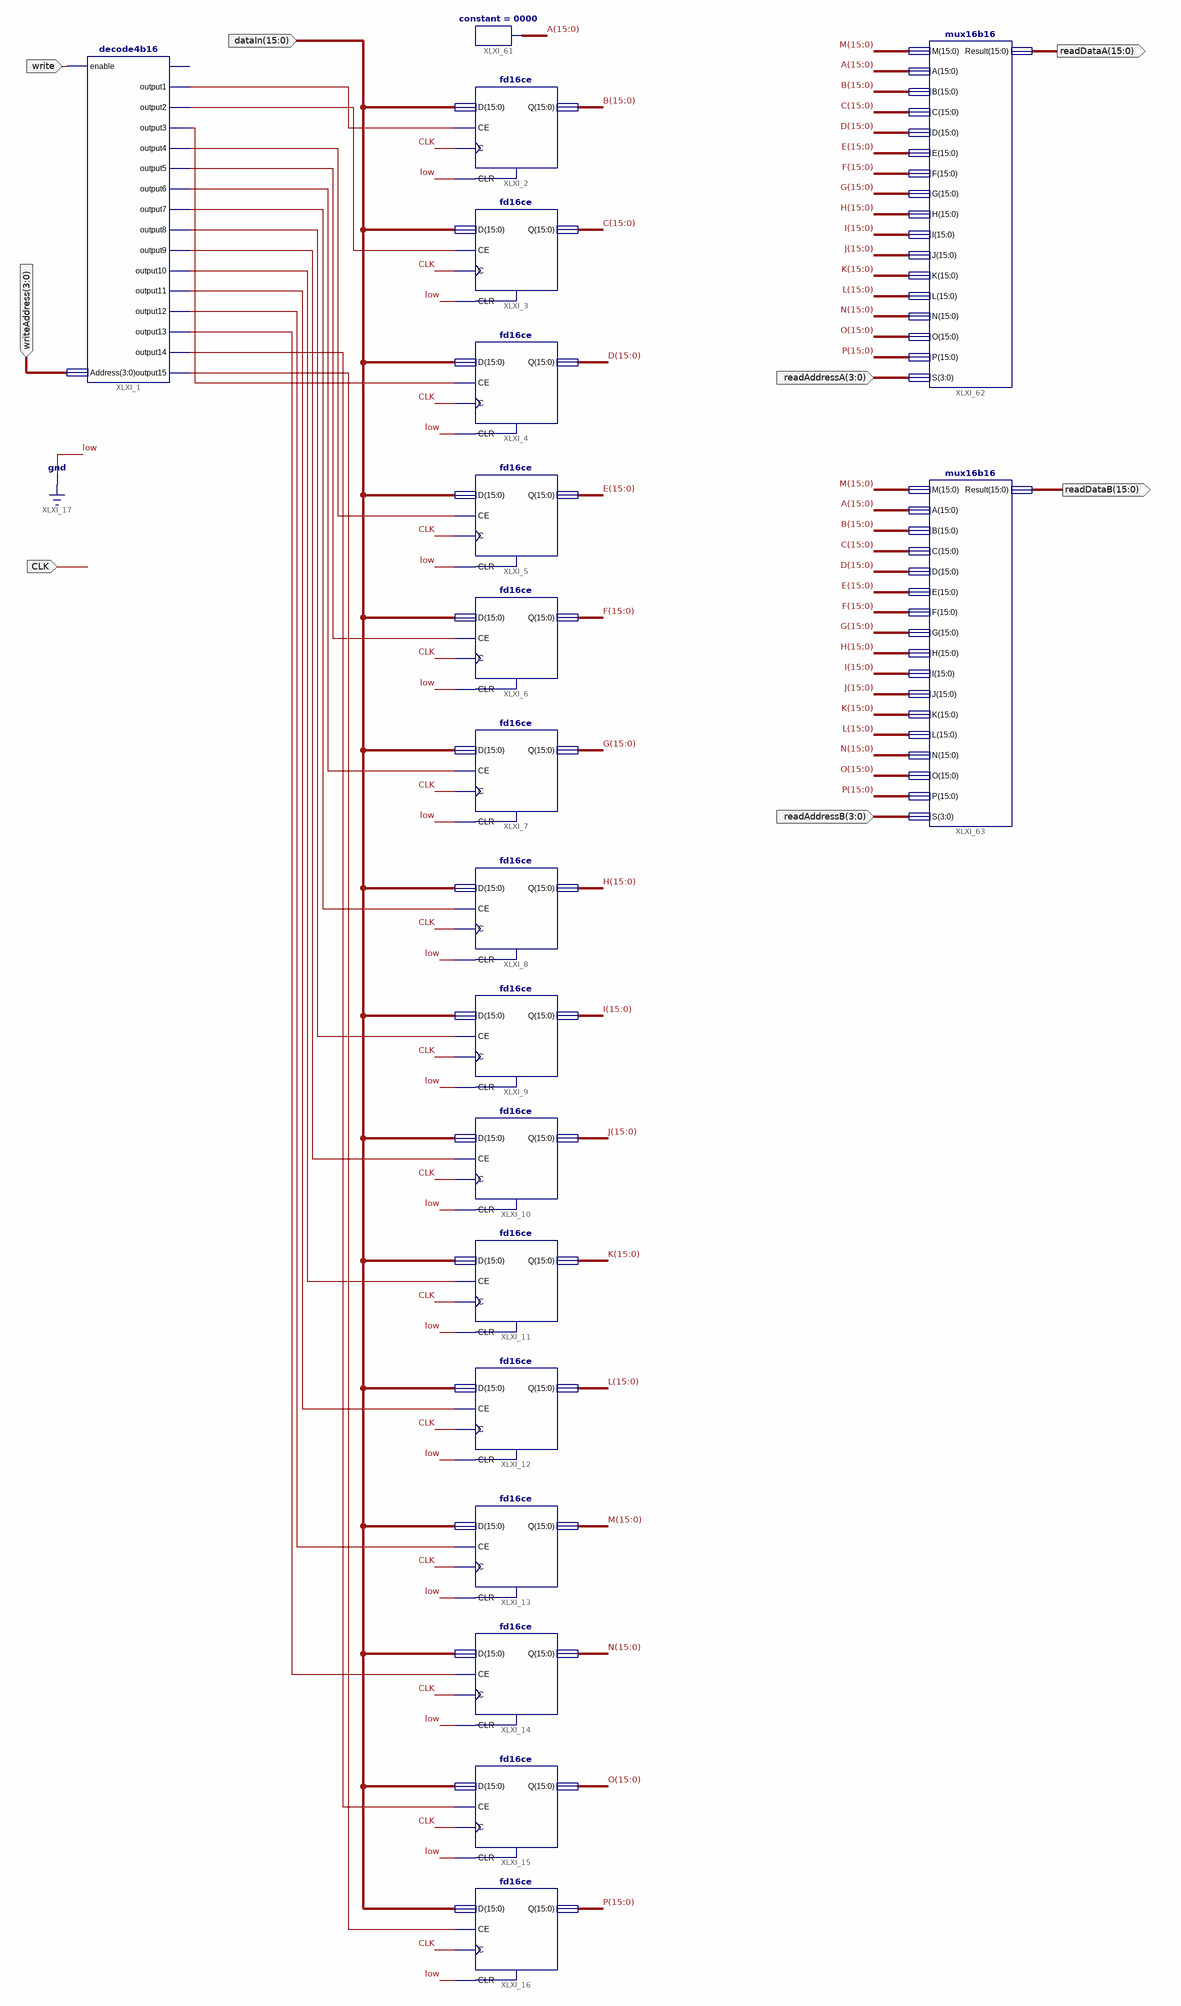
[diagram p0: schematic sheet 1]
// Xilinx ISE schematic regFile16b16.sch (spartan3e) as structural Verilog: 19 symbols, 8 ports
module regFile16b16 (
  input  write,
  input  [3:0] writeAddress,
  input  [15:0] dataIn,
  input  CLK,
  input  [3:0] readAddressA,
  input  [3:0] readAddressB,
  output [15:0] readDataB,
  output [15:0] readDataA
);

  wire XLXN_42, XLXN_44, XLXN_48, XLXN_50, XLXN_52, XLXN_54, XLXN_56, XLXN_58, XLXN_60, XLXN_62, XLXN_64,
       XLXN_67, XLXN_70, XLXN_72, XLXN_74;
  wire [15:0] A, B, C, D, E, F, G, H, I, J, K, L, M, N, O, P;

  decode4b16 XLXI_1 (
    .enable(write), .Address(writeAddress), .output1(XLXN_42), .output2(XLXN_44), .output3(XLXN_48),
    .output4(XLXN_50), .output5(XLXN_52), .output6(XLXN_54), .output7(XLXN_56), .output8(XLXN_58),
    .output9(XLXN_60), .output10(XLXN_62), .output11(XLXN_64), .output12(XLXN_67), .output13(XLXN_70),
    .output14(XLXN_72), .output15(XLXN_74));  // open: output0
  fd16ce XLXI_2 (.C(CLK), .CE(XLXN_42), .CLR(1'b0), .D(dataIn), .Q(B));
  fd16ce XLXI_3 (.C(CLK), .CE(XLXN_44), .CLR(1'b0), .D(dataIn), .Q(C));
  fd16ce XLXI_4 (.C(CLK), .CE(XLXN_48), .CLR(1'b0), .D(dataIn), .Q(D));
  fd16ce XLXI_5 (.C(CLK), .CE(XLXN_50), .CLR(1'b0), .D(dataIn), .Q(E));
  fd16ce XLXI_6 (.C(CLK), .CE(XLXN_52), .CLR(1'b0), .D(dataIn), .Q(F));
  fd16ce XLXI_7 (.C(CLK), .CE(XLXN_54), .CLR(1'b0), .D(dataIn), .Q(G));
  fd16ce XLXI_8 (.C(CLK), .CE(XLXN_56), .CLR(1'b0), .D(dataIn), .Q(H));
  fd16ce XLXI_9 (.C(CLK), .CE(XLXN_58), .CLR(1'b0), .D(dataIn), .Q(I));
  fd16ce XLXI_10 (.C(CLK), .CE(XLXN_60), .CLR(1'b0), .D(dataIn), .Q(J));
  fd16ce XLXI_11 (.C(CLK), .CE(XLXN_62), .CLR(1'b0), .D(dataIn), .Q(K));
  fd16ce XLXI_12 (.C(CLK), .CE(XLXN_64), .CLR(1'b0), .D(dataIn), .Q(L));
  fd16ce XLXI_13 (.C(CLK), .CE(XLXN_67), .CLR(1'b0), .D(dataIn), .Q(M));
  fd16ce XLXI_14 (.C(CLK), .CE(XLXN_70), .CLR(1'b0), .D(dataIn), .Q(N));
  fd16ce XLXI_15 (.C(CLK), .CE(XLXN_72), .CLR(1'b0), .D(dataIn), .Q(O));
  fd16ce XLXI_16 (.C(CLK), .CE(XLXN_74), .CLR(1'b0), .D(dataIn), .Q(P));
  constant #(.CValue("0000")) XLXI_61 (.O(A));
  mux16b16 XLXI_62 (
    .M(M), .A(A), .B(B), .C(C), .D(D), .E(E), .F(F), .G(G), .H(H), .I(I), .J(J), .K(K), .L(L), .N(N), .O(O),
    .P(P), .S(readAddressA), .Result(readDataA));
  mux16b16 XLXI_63 (
    .M(M), .A(A), .B(B), .C(C), .D(D), .E(E), .F(F), .G(G), .H(H), .I(I), .J(J), .K(K), .L(L), .N(N), .O(O),
    .P(P), .S(readAddressB), .Result(readDataB));
endmodule
